# Altium project LED circuit.PrjPcb
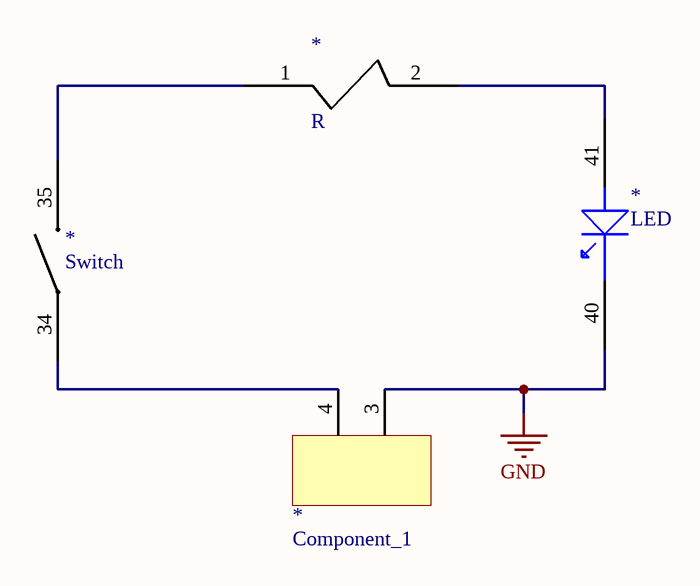
[diagram p0: Sheet1.SchDoc]
1 sheet, 4 parts. Net scope: global (net labels, ports and power ports of the same name join across sheets).
Board file: PCB1.PcbDoc

## Sheet Sheet1.SchDoc
size A; SheetNumber: 1; SheetTotal: 1

### Parts
Connector  Component_1  [Connector]
LED  LED  [LED]
Resistor  R  [Resistor0603]
Switch  Switch  [Swicth]

### Nets
GND: Connector.3 LED.40
NetConnector_4: Connector.4 Switch.34
NetLED_41: LED.41 Resistor.2
NetResistor_1: Resistor.1 Switch.35